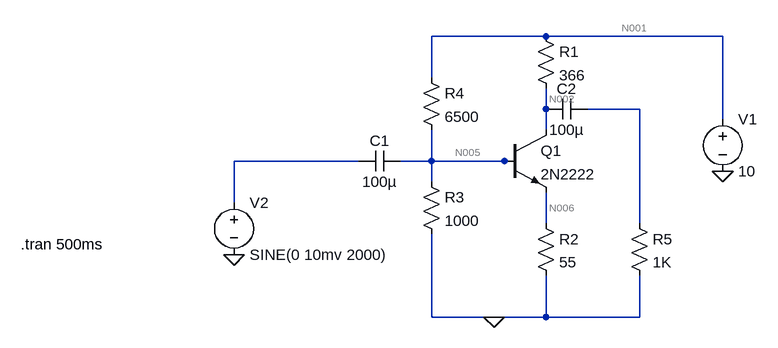
[diagram p0: schematic Test1.asc]
Test1.asc, the LTspice schematic file:
Version 4
SHEET 1 880 680
WIRE 224 -80 48 -80
WIRE 496 -80 224 -80
WIRE 48 -16 48 -80
WIRE 224 32 224 0
WIRE 368 32 288 32
WIRE 496 48 496 -80
WIRE 224 64 224 32
WIRE -64 112 -256 112
WIRE 48 112 48 64
WIRE 48 112 0 112
WIRE 160 112 48 112
WIRE 176 112 160 112
WIRE 48 144 48 112
WIRE -256 176 -256 112
WIRE 224 208 224 160
WIRE 368 208 368 32
WIRE 48 352 48 224
WIRE 144 352 48 352
WIRE 224 352 224 288
WIRE 224 352 144 352
WIRE 368 352 368 288
WIRE 368 352 224 352
FLAG 496 128 0
FLAG 144 352 0
FLAG -256 256 0
SYMBOL npn 160 64 R0
SYMATTR InstName Q1
SYMATTR Value 2N2222
SYMBOL res 208 -96 R0
SYMATTR InstName R1
SYMATTR Value 366
SYMBOL voltage 496 32 R0
WINDOW 123 0 0 Left 2
WINDOW 39 0 0 Left 2
SYMATTR InstName V1
SYMATTR Value 10
SYMBOL res 32 -32 R0
SYMATTR InstName R4
SYMATTR Value 6500
SYMBOL res 32 128 R0
SYMATTR InstName R3
SYMATTR Value 1000
SYMBOL res 208 192 R0
SYMATTR InstName R2
SYMATTR Value 55
SYMBOL cap 0 96 R90
WINDOW 0 0 32 VBottom 2
WINDOW 3 32 32 VTop 2
SYMATTR InstName C1
SYMATTR Value 100µ
SYMBOL voltage -256 160 R0
WINDOW 123 0 0 Left 2
WINDOW 39 0 0 Left 2
SYMATTR InstName V2
SYMATTR Value SINE(0 10mv 2000)
SYMBOL cap 288 16 R90
WINDOW 0 0 32 VBottom 2
WINDOW 3 32 32 VTop 2
SYMATTR InstName C2
SYMATTR Value 100µ
SYMBOL res 352 192 R0
SYMATTR InstName R5
SYMATTR Value 1K
TEXT -584 240 Left 2 !.tran 500ms

The netlist it stands for:
* Test1.asc
Q1 N002 N005 N006 0 2N2222
R1 N001 N002 366
V1 N001 0 10
R4 N001 N005 6500
R3 N005 0 1000
R2 N006 0 55
C1 N005 N004 100µ
V2 N004 0 SINE(0 10mv 2000)
C2 N003 N002 100µ
R5 N003 0 1K
.model NPN NPN
.model PNP PNP
.lib standard.bjt
.tran 500ms
.backanno
.end

* Results of the author's LTspice run, read from the files saved beside the schematic
* Operating Point, zero values left out:
*   V(n002) = 6.216 V
*   V(n005) = 1.289 V
*   V(n006) = 571.5 mV
*   V(n001) = 10 V
*   Ic(Q1) = 10.34 mA
*   Ib(Q1) = 50.89 µA
*   Ie(Q1) = -10.39 mA
*   I(R2) = 10.39 mA
*   I(R3) = 1.289 mA
*   I(R4) = 1.34 mA
*   I(R1) = 10.34 mA
*   I(V1) = -11.68 mA
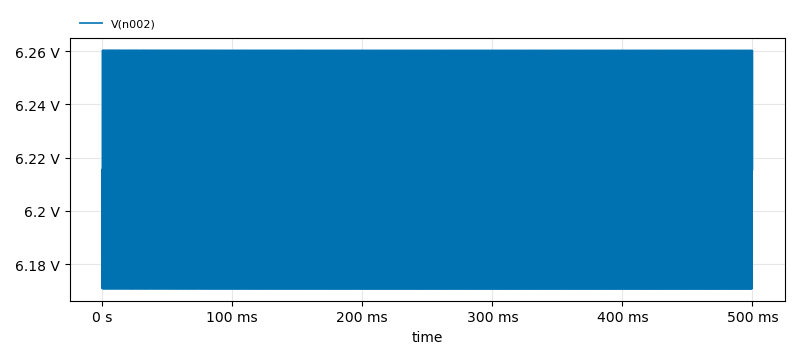
[diagram p1: Transient Analysis of Test1.asc, plotted from the saved traces]
* Transient Analysis, 1 run:
*   V(n002): min 6.17 V, max 6.261 V, average 6.216 V, rms 6.216 V, last 6.215 V